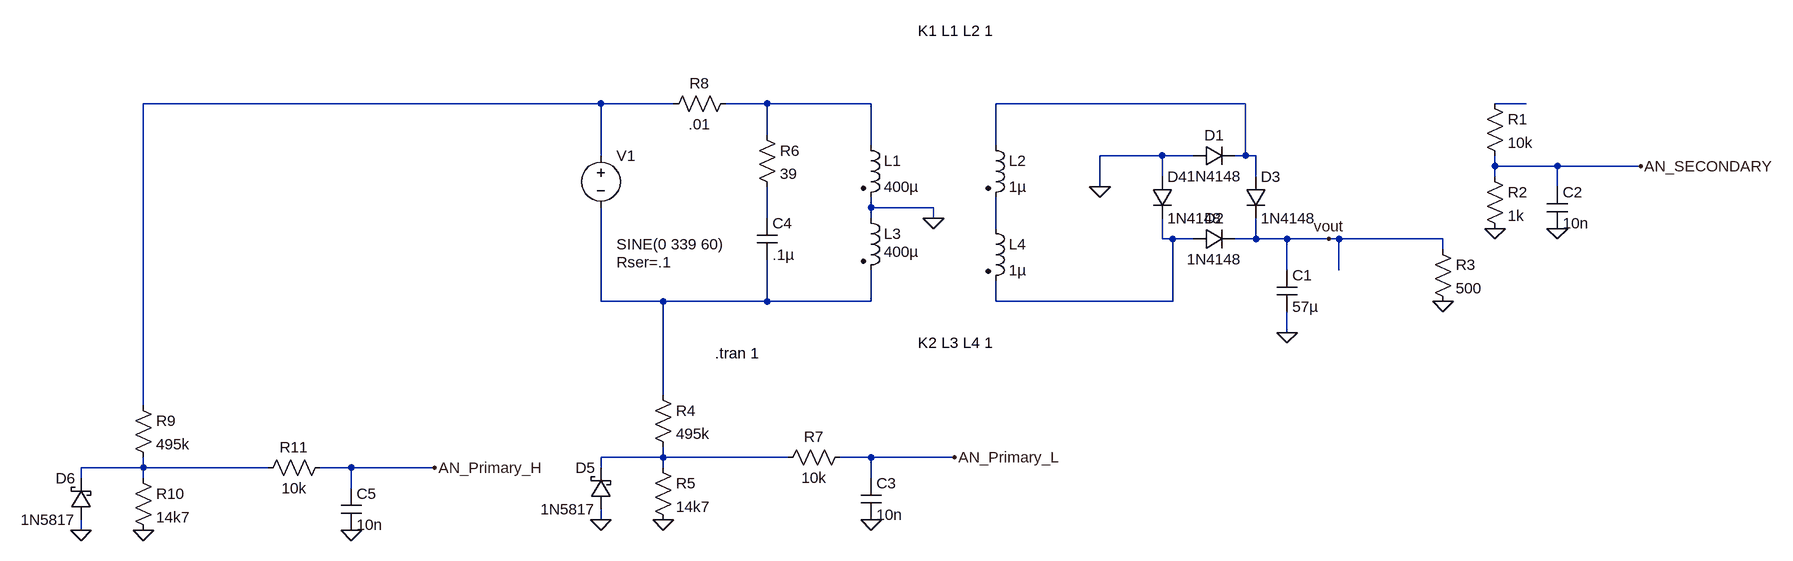
[diagram p0: schematic Welder_AC_Input.asc]
Welder_AC_Input.asc, the LTspice schematic file:
Version 4
SHEET 1 2136 756
WIRE -320 80 -1024 80
WIRE -208 80 -320 80
WIRE -64 80 -128 80
WIRE 96 80 -64 80
WIRE 672 80 288 80
WIRE 1104 80 1056 80
WIRE -64 128 -64 80
WIRE 96 144 96 80
WIRE 288 144 288 80
WIRE -320 160 -320 80
WIRE 544 160 448 160
WIRE 592 160 544 160
WIRE 672 160 672 80
WIRE 672 160 656 160
WIRE 688 160 672 160
WIRE 1056 176 1056 160
WIRE 1152 176 1056 176
WIRE 1280 176 1152 176
WIRE 544 192 544 160
WIRE 688 192 688 160
WIRE 1056 192 1056 176
WIRE 448 208 448 160
WIRE 1152 208 1152 176
WIRE 96 240 96 224
WIRE 192 240 96 240
WIRE -64 256 -64 208
WIRE 96 256 96 240
WIRE 192 256 192 240
WIRE 288 272 288 224
WIRE 544 288 544 256
WIRE 560 288 544 288
WIRE 592 288 560 288
WIRE 688 288 688 256
WIRE 688 288 656 288
WIRE 736 288 688 288
WIRE 800 288 736 288
WIRE 816 288 800 288
WIRE 976 288 816 288
WIRE 976 304 976 288
WIRE 736 336 736 288
WIRE 816 336 816 288
WIRE -320 384 -320 240
WIRE -224 384 -320 384
WIRE -64 384 -64 320
WIRE -64 384 -224 384
WIRE 96 384 96 336
WIRE 96 384 -64 384
WIRE 288 384 288 352
WIRE 560 384 560 288
WIRE 560 384 288 384
WIRE 736 432 736 400
WIRE -224 528 -224 384
WIRE -1024 544 -1024 80
WIRE -224 624 -224 608
WIRE -224 624 -320 624
WIRE -32 624 -224 624
WIRE 96 624 48 624
WIRE 224 624 96 624
WIRE -1024 640 -1024 624
WIRE -1024 640 -1120 640
WIRE -832 640 -1024 640
WIRE -704 640 -752 640
WIRE -576 640 -704 640
WIRE -320 640 -320 624
WIRE -224 640 -224 624
WIRE -1120 656 -1120 640
WIRE -1024 656 -1024 640
WIRE 96 656 96 624
WIRE -704 672 -704 640
WIRE -320 720 -320 704
WIRE -1120 736 -1120 720
FLAG 800 288 vout
FLAG 448 208 0
FLAG 736 432 0
FLAG 976 384 0
FLAG 1056 272 0
FLAG 1280 176 AN_SECONDARY
FLAG -224 720 0
FLAG 224 624 AN_Primary_L
FLAG 96 720 0
FLAG 1152 272 0
FLAG 192 256 0
FLAG -320 720 0
FLAG -1024 736 0
FLAG -576 640 AN_Primary_H
FLAG -704 736 0
FLAG -1120 736 0
SYMBOL voltage -320 144 R0
WINDOW 3 24 152 Left 2
WINDOW 123 24 124 Left 2
WINDOW 39 24 180 Left 2
SYMATTR Value SINE(0 339 60)
SYMATTR SpiceLine Rser=.1
SYMATTR InstName V1
SYMBOL ind2 80 128 R0
SYMATTR InstName L1
SYMATTR Value 400µ
SYMATTR Type ind
SYMBOL ind2 272 128 R0
SYMATTR InstName L2
SYMATTR Value 1µ
SYMATTR Type ind
SYMATTR SpiceLine Rser=4
SYMBOL diode 592 176 R270
WINDOW 0 32 32 VTop 2
WINDOW 3 0 32 VBottom 2
SYMATTR InstName D1
SYMATTR Value 1N4148
SYMBOL diode 592 304 R270
WINDOW 0 32 32 VTop 2
WINDOW 3 0 32 VBottom 2
SYMATTR InstName D2
SYMATTR Value 1N4148
SYMBOL diode 672 192 R0
SYMATTR InstName D3
SYMATTR Value 1N4148
SYMBOL diode 528 192 R0
SYMATTR InstName D4
SYMATTR Value 1N4148
SYMBOL cap 720 336 R0
SYMATTR InstName C1
SYMATTR Value 57µ
SYMBOL res 960 288 R0
SYMATTR InstName R3
SYMATTR Value 500
SYMBOL ind2 80 240 R0
WINDOW 3 36 68 Left 2
SYMATTR Value 400µ
SYMATTR InstName L3
SYMATTR Type ind
SYMBOL ind2 272 256 R0
SYMATTR InstName L4
SYMATTR Value 1µ
SYMATTR Type ind
SYMATTR SpiceLine Rser=4
SYMBOL res 1040 64 R0
SYMATTR InstName R1
SYMATTR Value 10k
SYMBOL res 1040 176 R0
SYMATTR InstName R2
SYMATTR Value 1k
SYMBOL res -240 512 R0
SYMATTR InstName R4
SYMATTR Value 495k
SYMBOL res -240 624 R0
SYMATTR InstName R5
SYMATTR Value 14k7
SYMBOL cap 1136 208 R0
SYMATTR InstName C2
SYMATTR Value 10n
SYMBOL cap 80 656 R0
SYMATTR InstName C3
SYMATTR Value 10n
SYMBOL res -80 112 R0
SYMATTR InstName R6
SYMATTR Value 39
SYMBOL cap -80 256 R0
SYMATTR InstName C4
SYMATTR Value .1µ
SYMBOL schottky -304 704 R180
WINDOW 0 24 64 Left 2
WINDOW 3 24 0 Left 2
SYMATTR InstName D5
SYMATTR Value 1N5817
SYMATTR Description Diode
SYMATTR Type diode
SYMBOL res 64 608 R90
WINDOW 0 0 56 VBottom 2
WINDOW 3 32 56 VTop 2
SYMATTR InstName R7
SYMATTR Value 10k
SYMBOL res -112 64 R90
WINDOW 0 0 56 VBottom 2
WINDOW 3 32 56 VTop 2
SYMATTR InstName R8
SYMATTR Value .01
SYMBOL res -1040 528 R0
SYMATTR InstName R9
SYMATTR Value 495k
SYMBOL res -1040 640 R0
SYMATTR InstName R10
SYMATTR Value 14k7
SYMBOL cap -720 672 R0
SYMATTR InstName C5
SYMATTR Value 10n
SYMBOL schottky -1104 720 R180
WINDOW 0 24 64 Left 2
WINDOW 3 24 0 Left 2
SYMATTR InstName D6
SYMATTR Value 1N5817
SYMATTR Description Diode
SYMATTR Type diode
SYMBOL res -736 624 R90
WINDOW 0 0 56 VBottom 2
WINDOW 3 32 56 VTop 2
SYMATTR InstName R11
SYMATTR Value 10k
TEXT 168 -32 Left 2 !K1 L1 L2 1
TEXT -144 464 Left 2 !.tran 1
TEXT 168 448 Left 2 !K2 L3 L4 1

The netlist it stands for:
* Welder_AC_Input.asc
V1 N001 N008 SINE(0 339 60) Rser=.1
L1 N002 0 400µ
L2 N003 N006 1µ Rser=4
D1 0 N003 1N4148
D2 N007 vout 1N4148
D3 N003 vout 1N4148
D4 0 N007 1N4148
C1 vout 0 57µ
R3 vout 0 500
L3 0 N008 400µ
L4 N006 N007 1µ Rser=4
R1 N004 AN_SECONDARY 10k
R2 AN_SECONDARY 0 1k
R4 N008 N009 495k
R5 N009 0 14k7
C2 AN_SECONDARY 0 10n
C3 AN_Primary_L 0 10n
R6 N002 N005 39
C4 N005 N008 .1µ
D5 0 N009 1N5817
R7 AN_Primary_L N009 10k
R8 N002 N001 .01
R9 N001 N010 495k
R10 N010 0 14k7
C5 AN_Primary_H 0 10n
D6 0 N010 1N5817
R11 AN_Primary_H N010 10k
.model D D
.lib standard.dio
K1 L1 L2 1
.tran 1
K2 L3 L4 1
.backanno
.end